# EAGLE design v1 (EAGLE 7.1.0)
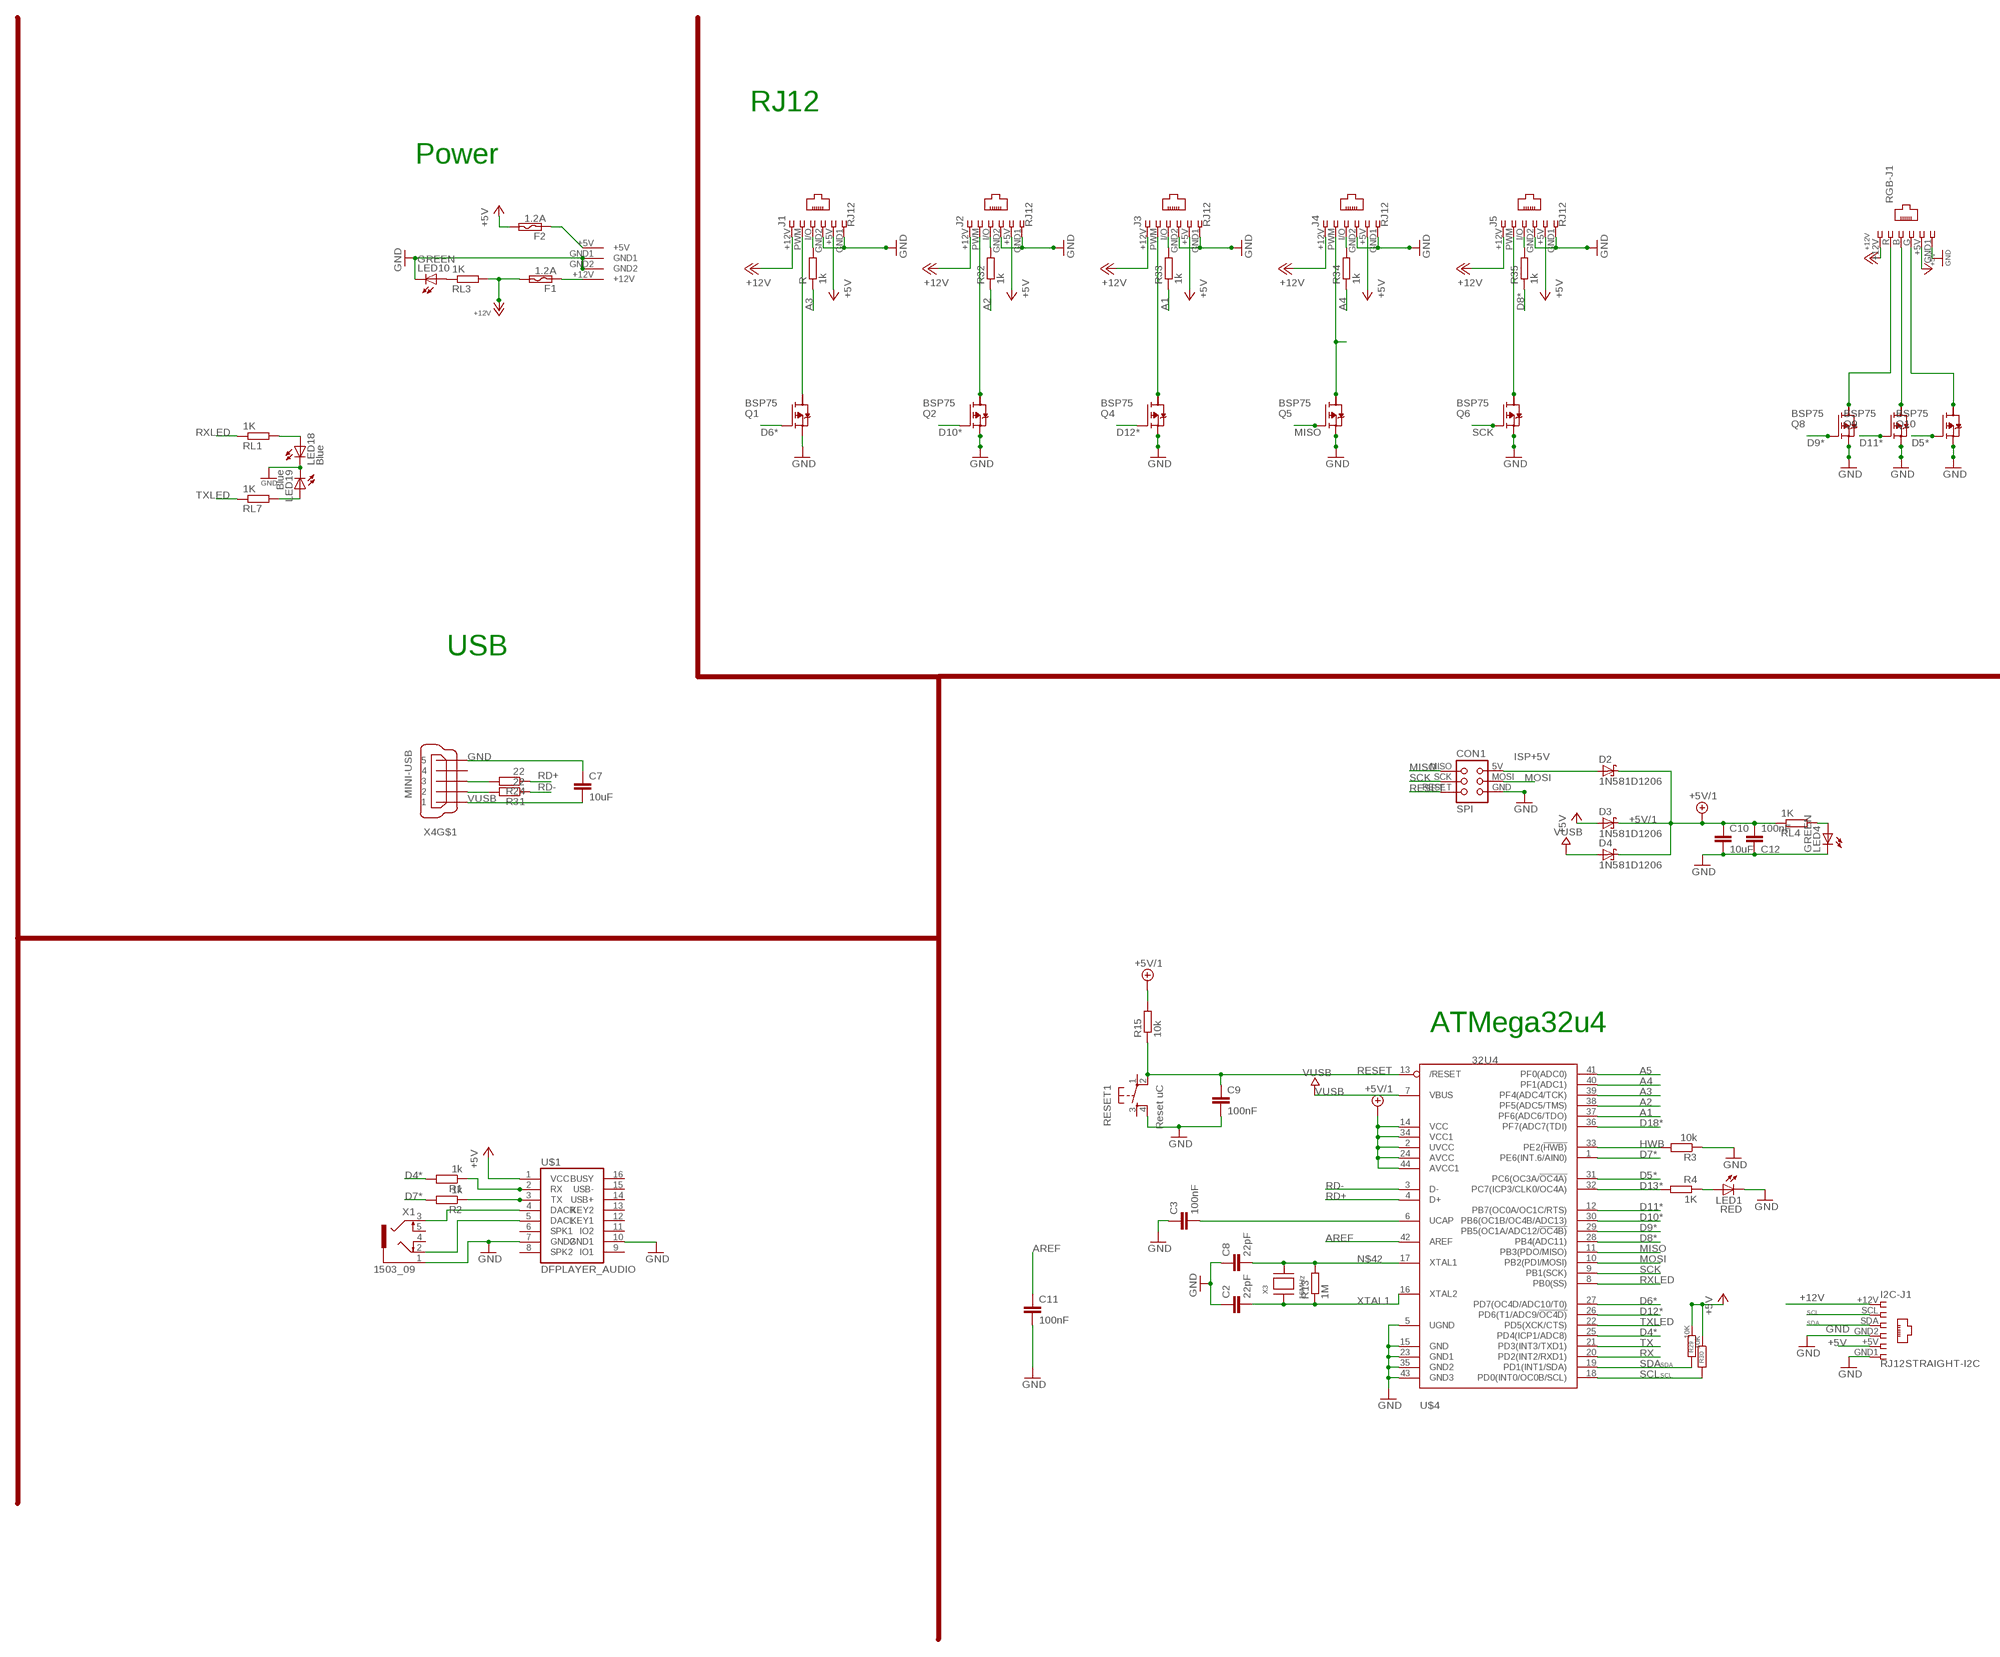
[diagram p0: schematic, sheet 1, part 1 of 2]
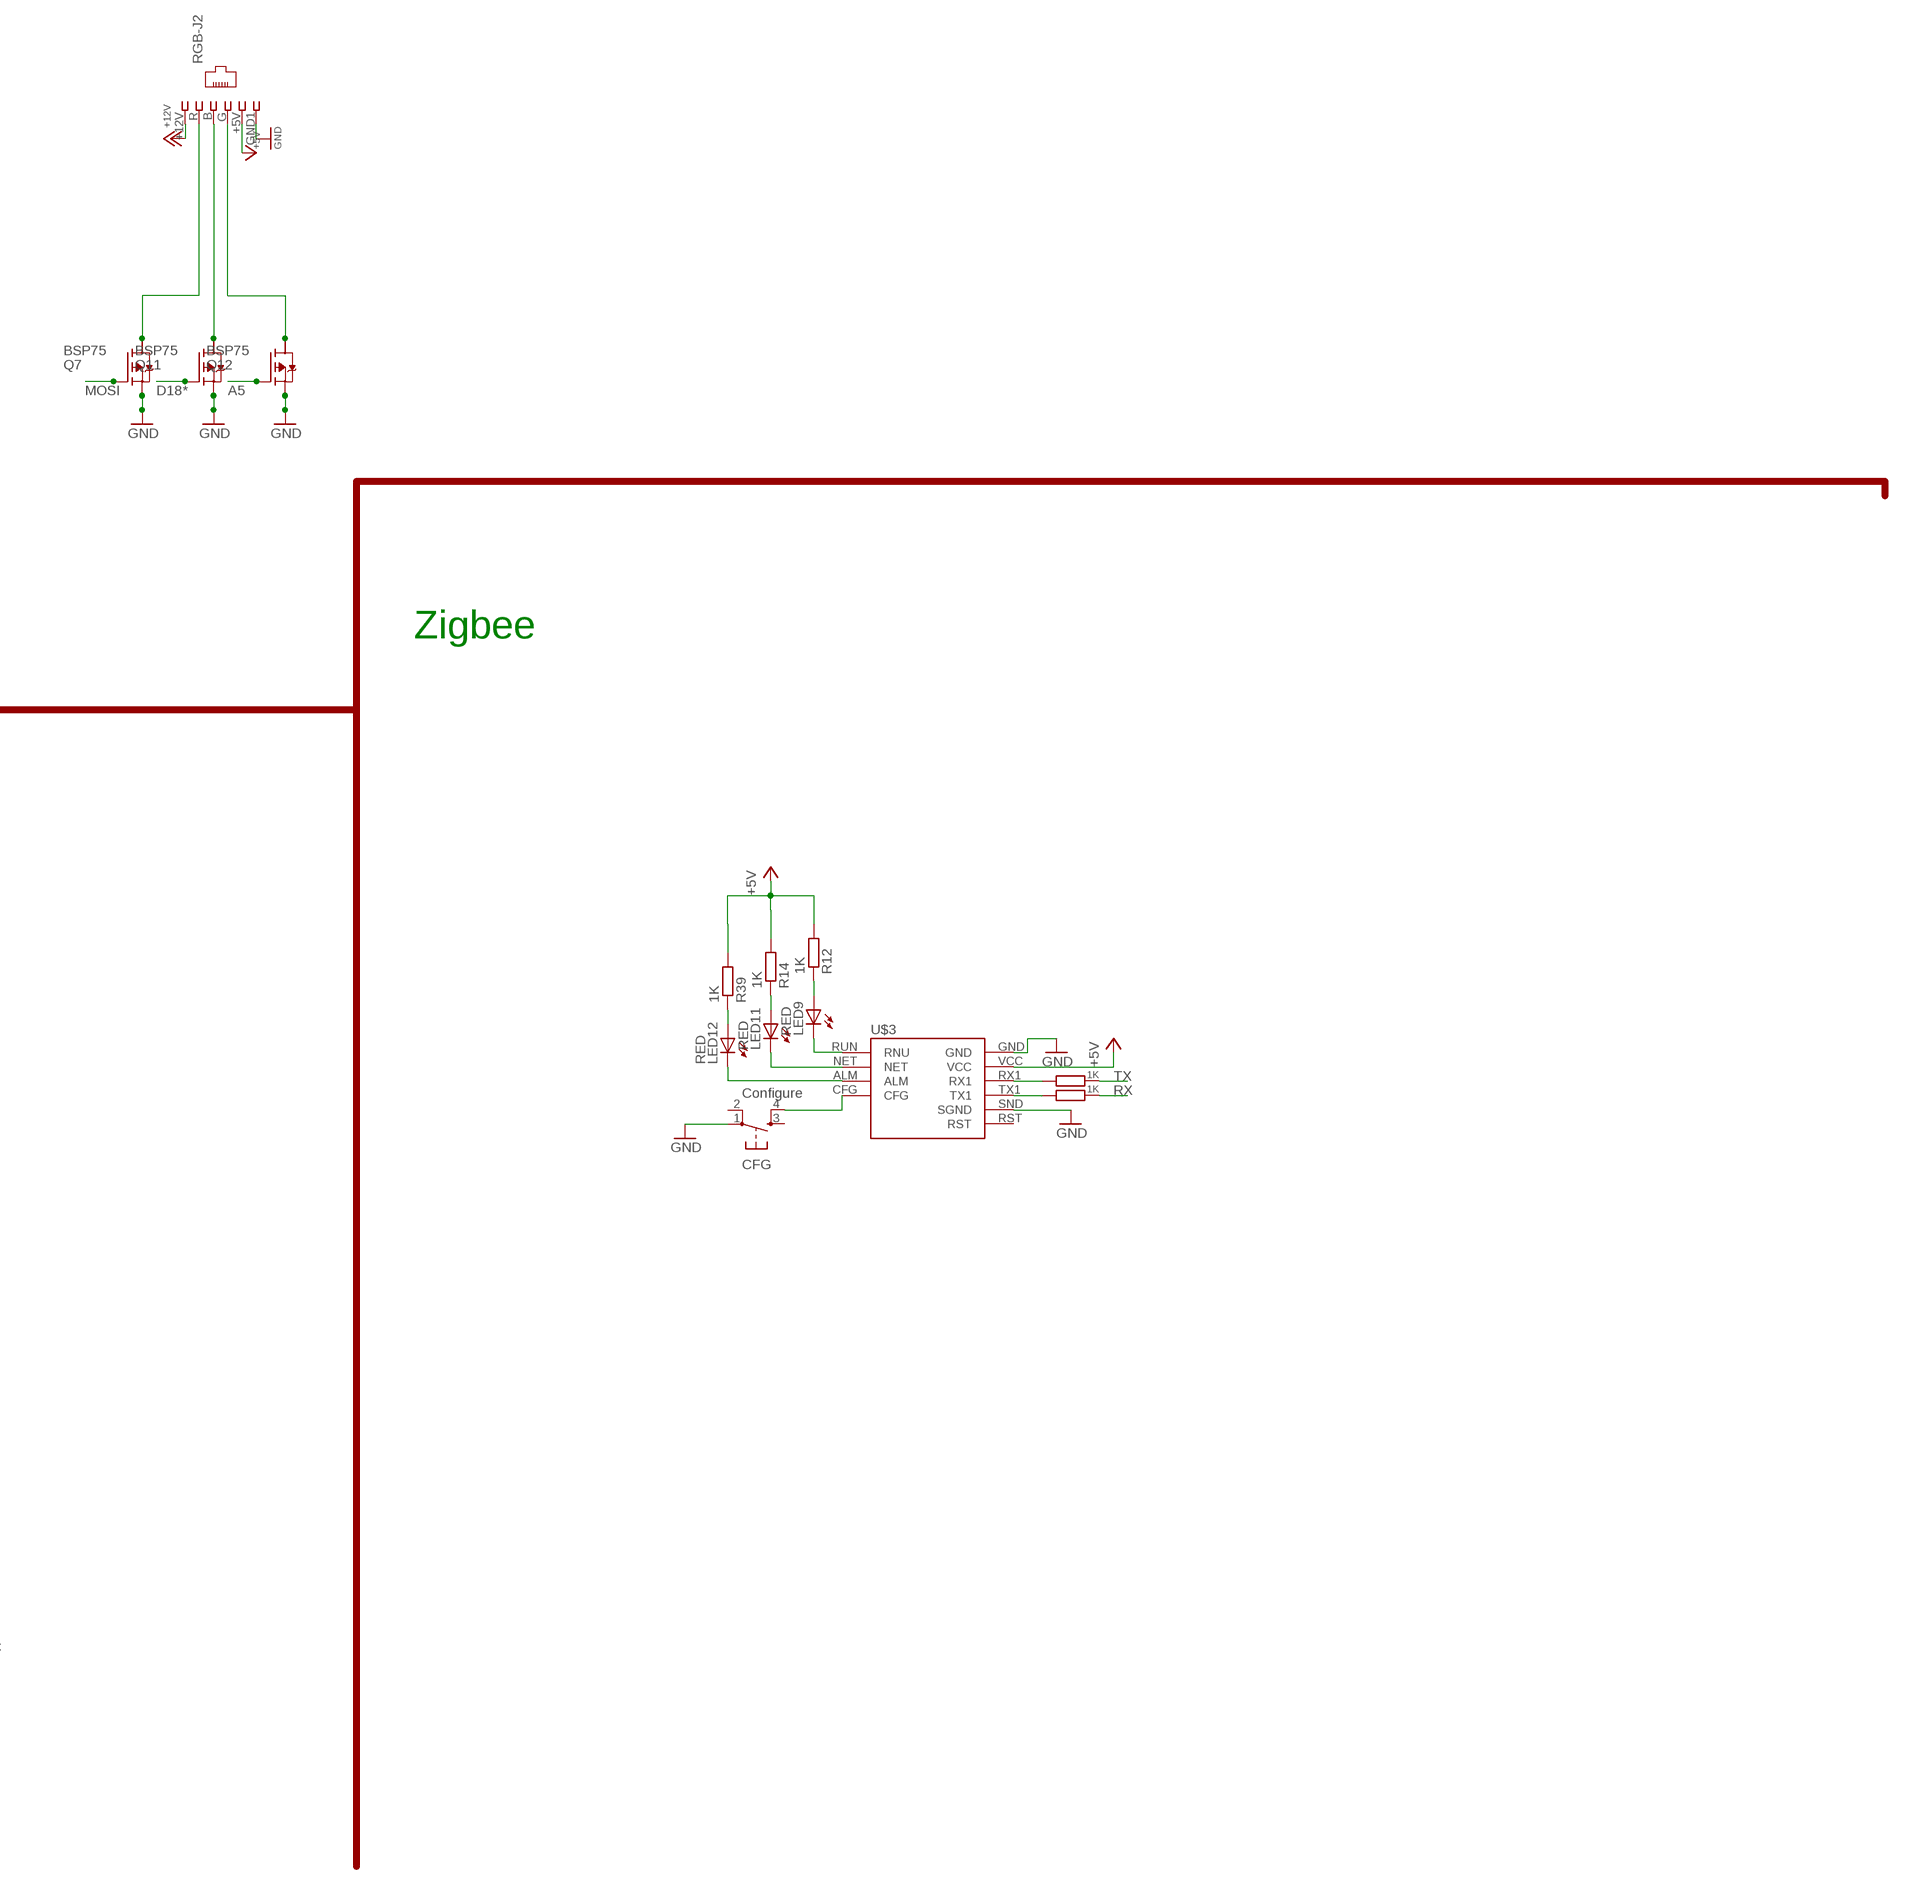
[diagram p1: schematic, sheet 1, part 2 of 2]

## Parts
C2  22pF  C-EUC1206  [C1206]
C3  100nF  C-EUC1206  [C1206]
C7  10uF  C-EUC1206  [C1206]
C8  22pF  C-EUC1206  [C1206]
C9  100nF  C-EUC1206  [C1206]
C10  10uF  C-EUC1206  [C1206]
C11  100nF  C-EUC1206  [C1206]
C12  100nF  C-EUC1206  [C1206]
CFG  Configure  TAC_SWITCHSMD  [TACTILE_SWITCH_SMD]
CON1  SPI  TINYISPT  [TC2030-MCP-NL]
D2  1N581D1206  [LED-1206]
D3  1N581D1206  [LED-1206]
D4  1N581D1206  [LED-1206]
F1  1.2A  POLYSWITCHSMD1812  [C1812]
F2  1.2A  POLYSWITCHSMD1812  [C1812]
I2C-J1  RJ12STRAIGHT-I2C  [RJ12-STRAIGHT-I2C]
J1  RJ12  RJ12STRAIGHT  [RJ12-STRAIGHT]
J2  RJ12  RJ12STRAIGHT  [RJ12-STRAIGHT]
J3  RJ12  RJ12STRAIGHT  [RJ12-STRAIGHT]
J4  RJ12  RJ12STRAIGHT  [RJ12-STRAIGHT]
J5  RJ12  RJ12STRAIGHT  [RJ12-STRAIGHT]
LED1  RED  LEDCHIP-LED0805  [CHIP-LED0805]
LED4  GREEN  LEDCHIP-LED0805  [CHIP-LED0805]
LED9  RED  LEDCHIP-LED0805  [CHIP-LED0805]
LED10  GREEN  LEDCHIP-LED0805  [CHIP-LED0805]
LED11  RED  LEDCHIP-LED0805  [CHIP-LED0805]
LED12  RED  LEDCHIP-LED0805  [CHIP-LED0805]
LED18  Blue  LEDCHIP-LED0805  [CHIP-LED0805]
LED19  Blue  LEDCHIP-LED0805  [CHIP-LED0805]
Q1  BSP75  BSP613P  [PG-SOT-223]
Q2  BSP75  BSP613P  [PG-SOT-223]
Q4  BSP75  BSP613P  [PG-SOT-223]
Q5  BSP75  BSP613P  [PG-SOT-223]
Q6  BSP75  BSP613P  [PG-SOT-223]
Q7  BSP75  BSP613P  [PG-SOT-223]
Q8  BSP75  BSP613P  [PG-SOT-223]
Q9  BSP75  BSP613P  [PG-SOT-223]
Q10  BSP75  BSP613P  [PG-SOT-223]
Q11  BSP75  BSP613P  [PG-SOT-223]
Q12  BSP75  BSP613P  [PG-SOT-223]
R  1k  R-EU_R0805  [R0805]
R1  1k  R-EU_R0805  [R0805]
R2  1k  R-EU_R0805  [R0805]
R3  10k  R-EU_M0805  [M0805]
R4  1K  R-EU_R0805  [R0805]
R8  1K  R-EU_R0805  [R0805]
R11  1K  R-EU_R0805  [R0805]
R12  1K  R-EU_R0805  [R0805]
R13  1M  R-EU_R1206  [R1206]
R14  1K  R-EU_R0805  [R0805]
R15  10k  R-EU_M0805  [M0805]
R24  22  R-EU_M1206  [M1206]
R29  10K  R-EU_M0805  [M0805]
R30  10K  R-EU_M0805  [M0805]
R31  22  R-EU_M1206  [M1206]
R32  1k  R-EU_R0805  [R0805]
R33  1k  R-EU_R0805  [R0805]
R34  1k  R-EU_R0805  [R0805]
R35  1k  R-EU_R0805  [R0805]
R39  1K  R-EU_R0805  [R0805]
RESET1  Reset uC  TAC_SWITCHSMD  [TACTILE_SWITCH_SMD]
RGB-J1  RJ12  RJ12STRAIGHT-RGB  [RJ12-STRAIGHT-RGB]
RGB-J2  RJ12  RJ12STRAIGHT-RGB  [RJ12-STRAIGHT-RGB]
RL1  1K  R-EU_R0805  [R0805]
RL3  1K  R-EU_R0805  [R0805]
RL4  1K  R-EU_R0805  [R0805]
RL7  1K  R-EU_R0805  [R0805]
U$1  DFPLAYER_AUDIO  [DIL16-7]
U$3  SZ05-ZIGBEESMD  [SZ05-ZIGBEE3]
U$4  32U4  ATMEGA32U4-AU  [TQFP44]
U$6  KPJX-4S-S  [KPJX-4S-S]
X1  1503_09  [1503_09]
X3  16MHz  XTALNX6035  [NX6035]
X4  MINI-USB  MINI-USB-SCHIELD-32005-201  [32005-201]

## Nets
+5V [power]: D3.A F2.2 I2C-J1.+5V J1.+5V J2.+5V J3.+5V J4.+5V J5.+5V R12.2 R14.2 R29.1 R30.1 R39.2 RGB-J1.+5V RGB-J2.+5V U$1.1(VCC) U$3.VCC
+5V/1 [fine]: C10.1 C12.2 D2.C D3.C D4.C R15.2 RL4.1 U$4.2(UVCC) U$4.14(VCC) U$4.24(AVCC) U$4.34(VCC1) U$4.44(AVCC1)
+12V [power]: F1.2 I2C-J1.+12V J1.+12V J2.+12V J3.+12V J4.+12V J5.+12V RGB-J1.+12V RGB-J2.+12V RL3.2
A1: R33.1 U$4.37(PF6(ADC6/TDO))
A2: R32.1 U$4.38(PF5(ADC5/TMS))
A3: R.1 U$4.39(PF4(ADC4/TCK))
A4: R34.1 U$4.40(PF1(ADC1))
A5: Q12.1(G) U$4.41(PF0(ADC0))
AREF: C11.1 U$4.42(AREF)
D4*: R1.2 U$4.25(PD4(ICP1/ADC8))
D5*: Q10.1(G) U$4.31(PC6(OC3A/!OC4A))
D6*: Q1.1(G) U$4.27(PD7(OC4D/ADC10/T0))
D7*: R2.2 U$4.1(PE6(INT.6/AIN0))
D8*: R35.1 U$4.28(PB4(ADC11))
D9*: Q8.1(G) U$4.29(PB5(OC1A/ADC12/!OC4B))
D10*: Q2.1(G) U$4.30(PB6(OC1B/OC4B/ADC13))
D11*: Q9.1(G) U$4.12(PB7(OC0A/OC1C/RTS))
D12*: Q4.1(G) U$4.26(PD6(T1/ADC9/!OC4D))
D13*: R4.2 U$4.32(PC7(ICP3/CLK0/OC4A))
D18*: Q11.1(G) U$4.36(PF7(ADC7(TDI))
D+USB: R24.2 X4.3
D-USB: R31.2 X4.2
GND [power]: C2.1 C3.1 C7.1 C8.1 C9.2 C10.2 C11.2 C12.1 CFG.1 CON1.GND I2C-J1.GND1 I2C-J1.GND2 J1.GND1 J1.GND2 J2.GND1 J2.GND2 J3.GND1 J3.GND2 J4.GND1 J4.GND2 J5.GND1 J5.GND2 LED1.C LED4.C LED10.C LED18.C LED19.C Q1.3(S) Q2.3(S) Q4.3(S) Q5.3(S) Q6.3(S) Q7.3(S) Q8.3(S) Q9.3(S) Q10.3(S) Q11.3(S) Q12.3(S) R3.1 RESET1.4 RGB-J1.GND1 RGB-J2.GND1 U$1.7(GND2) U$1.10(GND1) U$3.GND U$3.SND(SGND) U$4.5(UGND) U$4.15(GND) U$4.23(GND1) U$4.35(GND2) U$4.43(GND3) U$6.GND1 U$6.GND2 X1.1 X4.5
GND1 [VIN]: LED9.C U$3.RUN(RNU)
GND2 [VIN]: LED11.C U$3.NET
GND3 [VIN]: LED12.C U$3.ALM
HWB: R3.2 U$4.33(PE2(!HWB))
ISP+5V: CON1.5V(VCC) D2.A
MISO: CON1.MISO Q5.1(G) U$4.11(PB3(PDO/MISO))
MOSI: CON1.MOSI Q7.1(G) U$4.10(PB2(PDI/MOSI))
N$1: J3.PWM Q4.2(D)
N$2: J2.I/O R32.2
N$3: R1.1 U$1.2(RX)
N$4: LED1.A R4.1
N$5: J4.PWM Q5.2(D)
N$6 [aref]: Q10.2(D) RGB-J1.G
N$7: J3.I/O R33.2
N$8: LED18.A RL1.2
N$9: U$1.5(DACL) X1.2
N$10 [aref]: Q11.2(D) RGB-J2.B
N$11: R11.2 U$3.RX1
N$12: LED4.A RL4.2
N$13: R2.1 U$1.3(TX)
N$14: LED19.A RL7.2
N$15: U$1.4(DACR) X1.3
N$16: C3.2 U$4.6(UCAP)
N$18: J1.I/O R.2
N$19: J5.PWM Q6.2(D)
N$20 [aref]: Q7.2(D) RGB-J2.R
N$23 [aref]: Q12.2(D) RGB-J2.G
N$24: R8.2 U$3.TX1
N$25: LED9.A R12.1
N$26: LED11.A R14.1
N$27: LED12.A R39.1
N$28: J2.PWM Q2.2(D)
N$29: J4.I/O R34.2
N$32: J5.I/O R35.2
N$34: J1.PWM Q1.2(D)
N$35: CFG.4 U$3.CFG
N$38: F2.1 U$6.+5V
N$39: F1.1 U$6.+12V
N$42: C8.2 R13.2 U$4.17(XTAL1) X3.P$2
N$50 [aref]: Q9.2(D) RGB-J1.B
N$68 [aref]: Q8.2(D) RGB-J1.R
N$75: LED10.A RL3.1
RD+: R24.1 U$4.4(D+)
RD-: R31.1 U$4.3(D-)
RESET: C9.1 CON1.RESET R15.1 RESET1.2 U$4.13(/RESET)
RX: R8.1 U$4.20(PD2(INT2/RXD1))
RXLED: RL1.1 U$4.8(PB0(SS))
SCK: CON1.SCK Q6.1(G) U$4.9(PB1(SCK))
SCL: I2C-J1.SCL R30.2 U$4.18(PD0(INT0/OC0B/SCL))
SDA: I2C-J1.SDA R29.2 U$4.19(PD1(INT1/SDA))
TX: R11.1 U$4.21(PD3(INT3/TXD1))
TXLED: RL7.1 U$4.22(PD5(XCK/CTS))
VUSB: C7.2 D4.A U$4.7(VBUS) X4.1
XTAL1: C2.2 R13.1 U$4.16(XTAL2) X3.P$1
Unconnected: CFG.2 CFG.3 Q1.4(D) Q2.4(D) Q4.4(D) Q5.4(D) Q6.4(D) Q7.4(D) Q8.4(D) Q9.4(D) Q10.4(D) Q11.4(D) Q12.4(D) RESET1.1 RESET1.3 U$1.6(SPK1) U$1.8(SPK2) U$1.9(IO1) U$1.11(IO2) U$1.12(KEY1) U$1.13(KEY2) U$1.14(USB+) U$1.15(USB-) U$1.16(BUSY) U$3.RST X1.4 X1.5 X4.4 X4.M1(S:S1) X4.M2(S:S2) X4.M3(S:S3) X4.M4(S:S4)

## Notes on the sheet
- RJ12
- Power
- Zigbee
- USB
- ATMega32u4

## Library data of the parts
C2 C3 C7-C12 = rcl:C-EU: CAPACITOR, European symbol
CFG RESET1 = lpatiny:TAC_SWITCH: Momentary Switch Button commonly used for reset or general input. Spark Fun Electronics SKU : COM-00097
CON1 = lpatiny:TINYISP: CONNECTOR
D2-D4 = lpatiny:1N581*: 1.0A SCHOTTKY BARRIER RECTIFIER Source: http://www.diodes.com/datasheets/ds23001.pdf
F1 F2 = lpatiny:POLYSWITCH: PolySwitch (TM) Resettable Device Source: Data sheet <http://www.farnell.com/datasheets/13482.pdf>
I2C-J1 J1-J5 RGB-J1 RGB-J2 = lpatiny:RJ12: CORCOM Modular RJ Jacks No Shield Source: www.tycoelectronics.com .. ENG_DS_1654001_1099_RJ_L_0507.pdf
LED1 LED4 LED9-LED12 LED18 LED19 = adafruit:LED: LED OSRAM: - CHIPLED LG R971, LG N971, LY N971, LG Q971, LY Q971, LO R971, LY R971 LH N974, LH R974 LS Q976, LO Q976, LY Q976 LO Q996 - Hyper CHIPLED LW Q18S LB Q993, LB Q99A, LB R99A - SideLED LS A670, LO A670, LY A670, LG A670, LP A670 LB A673, LV A673, LT A673, LW A673 LH A674 LY A675 LS A676, LA A676, LO A676, LY A676, LW A676 LS A679, LY A679, LG A679 - Hyper Micro SIDELED® LS Y876, LA Y876, LO Y876, LY Y876 LT Y87S - SmartLED LW L88C, LW L88S LB L89C, LB L89S, LG L890 LS L89K, LO L89K, LY L89K LS L896, LA L896, LO L896, LY L896 - TOPLED LS T670, LO T670, LY T670, LG T670, LP T670 LSG T670, LSP T670, LSY T670, LOP T670, LYG T670 LG T671, LOG T671, LSG T671 LB T673, LV T673, LT T673, LW T673 LH T674 LS T676, LA T676, LO T676, LY T676, LB T676, LH T676, LSB T676, LW T676 LB T67C, LV T67C, LT T67C, LS T67K, LO T67K, LY T67K, LW E67C LS E67B, LA E67B, LO E67B, LY E67B, LB E67C, LV E67C, LT E67C LW T67C LS T679, LY T679, LG T679 LS T770, LO T770, LY T770, LG T770, LP T770 LB T773, LV T773, LT T773, LW T773 LH T774 LS E675, LA E675, LY E675, LS T675 LS T776, LA T776, LO T776, LY T776, LB T776 LHGB T686 LT T68C, LB T68C - Hyper Mini TOPLED® LB M676 - Mini TOPLED Santana® LG M470 LS M47K, LO M47K, LY M47K Source: http://www.osram.convergy.de/
Q1 Q2 Q4-Q12 = infineon:BSP613P: SIPMOS (R) Small-Signal-Transistor P-Channel (2 Drain) Source: http://www.infineon.com/dgdl/BSP613P_Rev2.4.pdf; OC_FARNELL: unknown; OC_NEWARK: unknown
R R1 R2 R4 R8 R11-R14 R32-R35 R39 RL1 RL3 RL7 = rcl:R-EU_: RESISTOR, European symbol
R3 R15 R24 R29-R31 RL4 = resistor:R-EU_: RESISTOR, European symbol
U$1 = lpatiny:DFPLAYER_AUDIO
U$3 = lpatiny:SZ05-ZIGBEE
U$4 = adafruit:ATMEGA32U4: http://www.ladyada.net/library/eagle
U$6 = lpatiny:KPJX-4S-S
X1 = con-lumberg:1503_09: Jack connectors according to JISC 6560, 3.5 mm Klinkeneinbaukupplung nach JISC 6560, 3,5 mm, 3-polig/ stereo, abgewinkelte Ausführung, mit 2 Öffnern und Lötaugen, für Leiterplatten Rückseitenmontage Source: http://www.lumberg.com/Produkte/PDFs/1503_09.pdf; OC_FARNELL: 1243244; OC_NEWARK: unknown
X3 = lpatiny:XTAL: Low cost SMT crystals, no capacitors included http://www.ladyada.net/library/eagle
X4 = con-cypressindustries:MINI-USB-SCHIELD-: MINI USB-B Conector Source: www.cypressindustries.com; OC_FARNELL: unknown; OC_NEWARK: unknown

## Net classes
0 default: width 0.406 mm
1 power: width 0.457 mm
2 VIN: width 0.457 mm
3 fine: width 0.406 mm
4 aref: width 0.406 mm

## Board
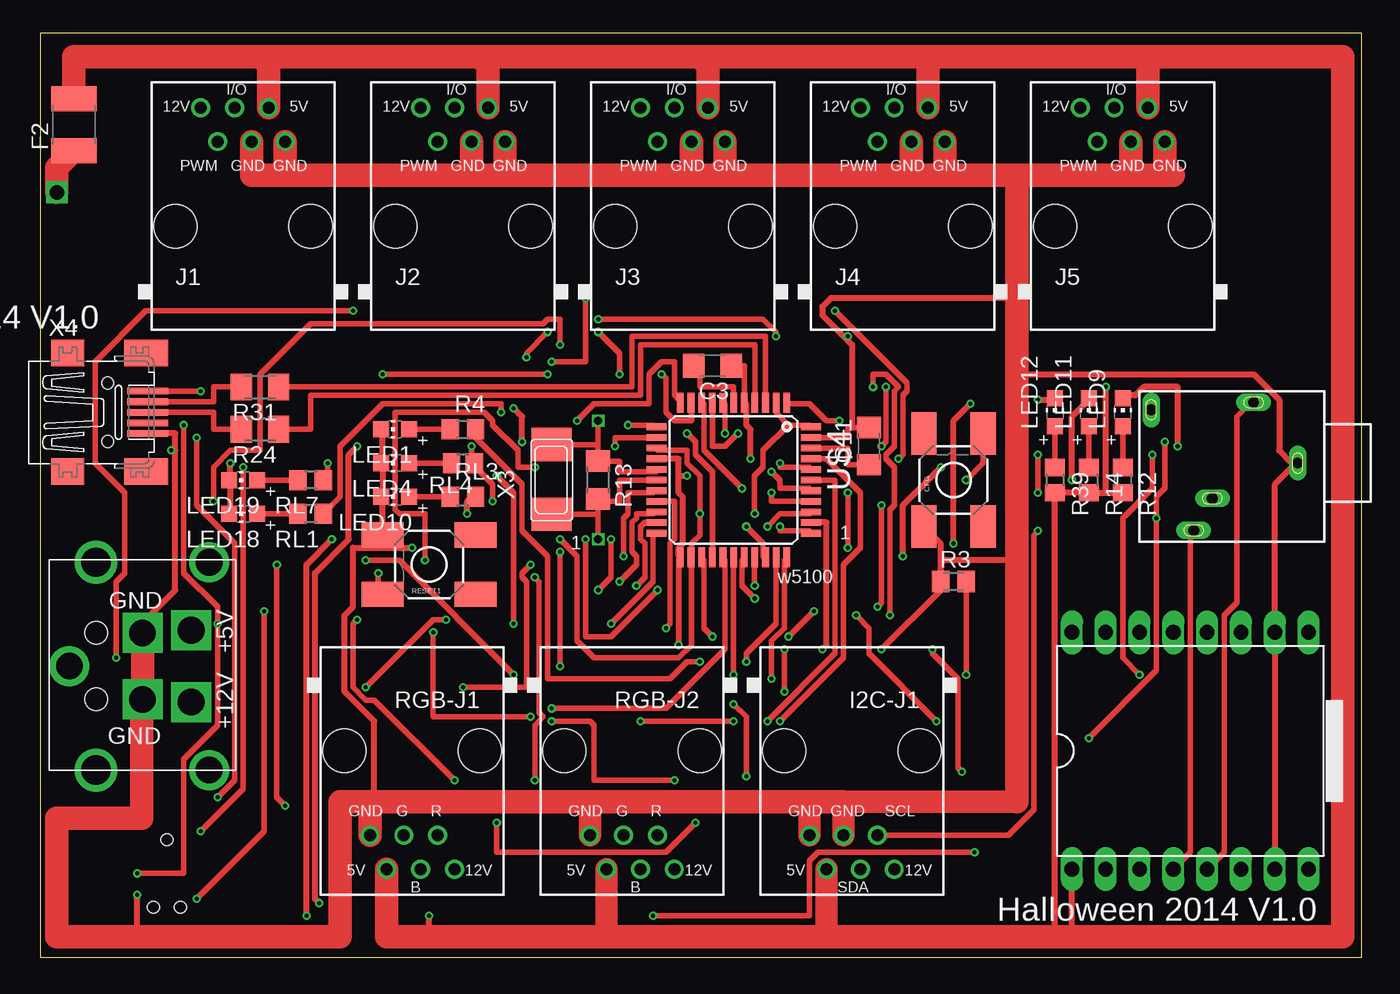
[diagram p2: board, top side]
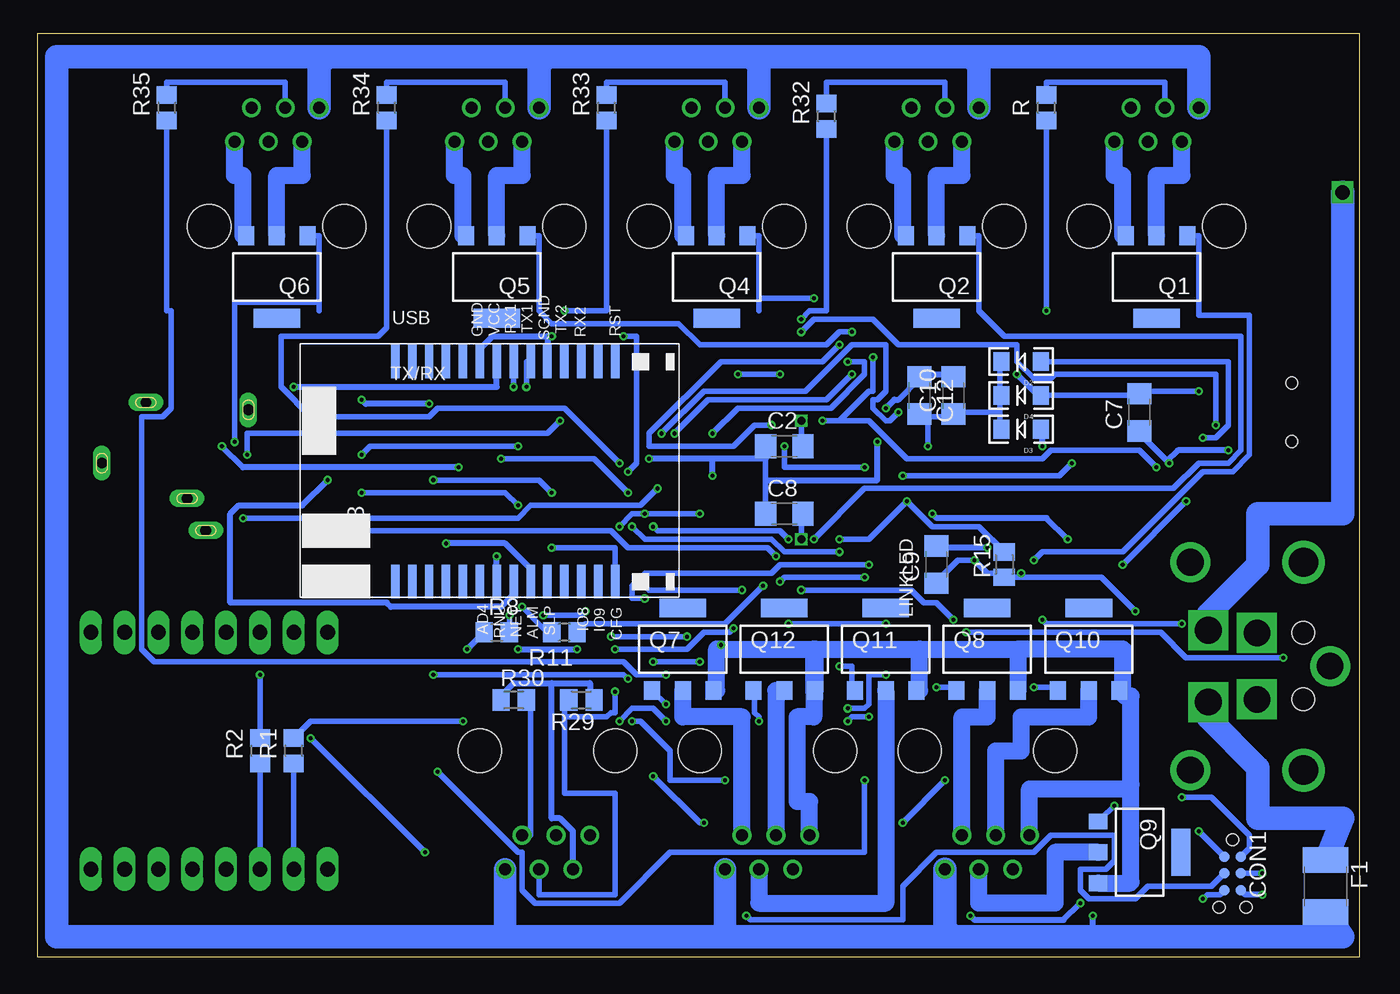
[diagram p3: board, bottom side, seen from below]

Size 99.24 x 69.33 mm. Coordinates in mm from the lower left corner, seen from the top.
Outline: 0,0 99.24,0 99.24,69.33 0,69.33 0,0
Copper layers (1*16): Top 0.035mm / dielectric 1.5mm / Bottom 0.035mm
Design rules "Fusion_eagle_rule_v1.1": minimum track width 6mil, minimum drill 12mil, track to track 6mil, track to pad 6mil, pad to pad 6mil, via to via 6mil, smd to smd 0mil, copper to edge 10mil, drill to drill 10mil, minimum pad ring 10mil, minimum via ring 6mil, stop-mask expansion 2mil, vias tented up to drill 100mil, thermal gap 10mil
bKeepout: area -1.3,54.9 to 114.3,82.8; area -7.6,52.3 to 108,80.3
tRestrict: area 0,51.1 to 95.2,72.6
bRestrict: area 0,49.8 to 95.2,71.4
vRestrict: area 44.5,28.2 to 59.7,32; area 44.5,29.5 to 48.3,43.4; area 55.9,30.7 to 59.7,43.4; area 44.5,39.6 to 59.7,43.4; area 7.6,4.1 to 11.4,9.1

### Footprints (pad centres in the part's own frame; a part is rotated, then mirrored left to right if it is on the bottom)
C1206 = smd 1.6 x 1.8: 1 -1.4,0; 2 1.4,0
TACTILE_SWITCH_SMD = smd 3.175 x 1.905: 1 -3.493,2.223; 2 3.493,2.223; 3 -3.493,-2.223; 4 3.493,-2.223
TC2030-MCP-NL = smd 0.787 x 0.787: 5V 1.27,0.635; GND 3.81,0.635; MISO 1.27,-0.635; MOSI 2.54,0.635; RESET 3.81,-0.635; SCK 2.54,-0.635 | hole 0.889: 0,0; 5.08,-1.016; 5.08,1.016
LED-1206 = smd 1.2 x 1.4: A -1.5,0; C 1.5,0
C1812 = smd 1.9 x 3.4: 1 -1.95,0; 2 1.95,0
RJ12-STRAIGHT-I2C = drill 0.9 pad 1.4: +5V 1.905,8.89; +12V -3.175,8.89; GND1 3.175,6.35; GND2 0.635,6.35; SCL -1.905,6.35; SDA -0.635,8.89 | hole 3.251: -5.08,0; 5.08,0
RJ12-STRAIGHT = drill 0.9 pad 1.4: +5V 1.905,8.89; +12V -3.175,8.89; GND1 3.175,6.35; GND2 0.635,6.35; I/O -0.635,8.89; PWM -1.905,6.35 | hole 3.251: -5.08,0; 5.08,0
CHIP-LED0805 = smd 1.2 x 1.2: A 0,-1.05; C 0,1.05
PG-SOT-223 = smd 1.2 x 1.4: 1 -2.311,-3.099; 2 0,-3.099; 3 2.311,-3.099 | smd 3.5 x 1.4: 4 0,3.099
R0805 = smd 1.3 x 1.5: 1 -0.95,0; 2 0.95,0
M0805 = smd 1.3 x 1.6: 1 -0.95,0; 2 0.95,0
R1206 = smd 1.6 x 1.803: 1 -1.422,0; 2 1.422,0
M1206 = smd 1.6 x 2: 1 -1.4,0; 2 1.4,0
RJ12-STRAIGHT-RGB = drill 0.9 pad 1.4: +5V 1.905,8.89; +12V -3.175,8.89; B -0.635,8.89; G 0.635,6.35; GND1 3.175,6.35; R -1.905,6.35 | hole 3.251: -5.08,0; 5.08,0
R0805' = smd 1.3 x 1.5: 1 -0.85,0; 2 0.85,0
DIL16-7 = drill 1.1 long: 1 -8.89,-8.89; 2 -6.35,-8.89; 3 -3.81,-8.89; 4 -1.27,-8.89; 5 1.27,-8.89; 6 3.81,-8.89; 7 6.35,-8.89; 8 8.89,-8.89; 9 8.89,8.89; 10 6.35,8.89; 11 3.81,8.89; 12 1.27,8.89; 13 -1.27,8.89; 14 -3.81,8.89; 15 -6.35,8.89; 16 -8.89,8.89
SZ05-ZIGBEE3 = smd 2.54 x 0.635: AD1 -7.62,6.35; AD2 -7.62,5.08; AD3 -7.62,3.81; AD4 -7.62,2.54; ALM -7.62,-1.27; C485 -7.62,-3.81; CFG -7.62,-7.62; GND 8.89,2.54; IO1 -7.62,8.89; IO2 -7.62,7.62; IO3 8.89,8.89; IO4 8.89,7.62; IO5 8.89,6.35; IO6 8.89,5.08; IO7 8.89,3.81; IO8 -7.62,-5.08; IO9 -7.62,-6.35; MS 8.89,-6.35; NET -7.62,0; RST 8.89,-7.62; RUN -7.62,1.27; RX1 8.89,0; RX2 8.89,-5.08; SLD -7.62,-2.54; SND 8.89,-2.54; TX1 8.89,-1.27; TX2 8.89,-3.81; VCC 8.89,1.27
TQFP44 = smd 1.5 x 0.5: 1 -5.8,4; 2 -5.8,3.2; 3 -5.8,2.4; 4 -5.8,1.6; 5 -5.8,0.8; 6 -5.8,0; 7 -5.8,-0.8; 8 -5.8,-1.6; 9 -5.8,-2.4; 10 -5.8,-3.2; 11 -5.8,-4; 23 5.8,-4; 24 5.8,-3.2; 25 5.8,-2.4; 26 5.8,-1.6; 27 5.8,-0.8; 28 5.8,0; 29 5.8,0.8; 30 5.8,1.6; 31 5.8,2.4; 32 5.8,3.2; 33 5.8,4 | smd 0.5 x 1.5: 12 -4,-5.8; 13 -3.2,-5.8; 14 -2.4,-5.8; 15 -1.6,-5.8; 16 -0.8,-5.8; 17 0,-5.8; 18 0.8,-5.8; 19 1.6,-5.8; 20 2.4,-5.8; 21 3.2,-5.8; 22 4,-5.8; 34 4,5.8; 35 3.2,5.8; 36 2.4,5.8; 37 1.6,5.8; 38 0.8,5.8; 39 0,5.8; 40 -0.8,5.8; 41 -1.6,5.8; 42 -2.4,5.8; 43 -3.2,5.8; 44 -4,5.8
KPJX-4S-S = drill 2 square: +5V 2.7,1.35; +12V -2.7,1.35; GND1 -2.5,5; GND2 2.5,5 | drill 2: P$1 -7.8,0; P$2 7.8,0; P$11 0,10.5 | drill 2.2: P$3 -7.8,8.5; P$4 7.8,8.5 | hole 1.7: -2.5,8.5; 2.5,8.5
1503_09 = drill 0.8 pad 1.2 long: 1 0,-2.1; 2 -4.55,-5.4; 3 5.05,-9.9; 4 -4,-13.1; 5 2.65,-8.5
NX6035 = smd 2.5 x 3: P$1 2.665,0; P$2 -2.565,0
32005-201 = smd 3.1 x 0.5: 1 3,1.6; 2 3,0.8; 3 3,0; 4 3,-0.8; 5 3,-1.6 | smd 2.5 x 2: M1 -3,-4.45; M2 -3,4.45 | smd 3.3 x 2: M3 2.9,4.45; M4 2.9,-4.45 | hole 0.9: 0,2.2; 0,-2.2

### Placement (x,y rotation side)
C2  43.18,38.35 0 bottom
C3  50.48,44.39 180 top
C7  16.51,40.89 90 bottom
C8  43.18,33.27 0 bottom
C9  31.75,29.46 90 bottom
C10  30.48,42.16 90 bottom
C11  62.23,38.35 90 top
C12  33.02,42.16 270 bottom
CFG  68.58,35.81 90 top
CON1  9.53,8.83 270 bottom
D2  25.4,44.7 180 bottom
D3  25.4,39.62 180 bottom
D4  25.4,42.16 180 bottom
F1  2.54,5.33 270 bottom
F2  2.54,62.48 90 top
I2C-J1  60.96,15.49 180 top
J1  15.24,54.86 0 top
J2  31.75,54.86 0 top
J3  48.26,54.86 0 top
J4  64.77,54.86 0 top
J5  81.28,54.86 0 top
LED1  26.67,39.62 90 top
LED4  26.67,37.08 90 top
LED9  81.28,40.89 0 top
LED10  26.67,34.54 90 top
LED11  78.74,40.89 0 top
LED12  76.2,40.89 0 top
LED18  15.24,33.27 90 top
LED19  15.24,35.81 90 top
Q1  15.24,51.05 180 bottom
Q2  31.75,51.05 180 bottom
Q4  48.26,51.05 180 bottom
Q5  64.77,51.05 180 bottom
Q6  81.28,51.05 180 bottom
Q7  50.8,23.11 0 bottom
Q8  27.94,23.11 0 bottom
Q9  16.51,7.87 270 bottom
Q10  20.32,23.11 0 bottom
Q11  35.56,23.11 0 bottom
Q12  43.18,23.11 0 bottom
R  23.5,63.75 90 bottom
R1  80.01,15.49 90 bottom
R2  82.55,15.49 90 bottom
R3  68.58,28.19 0 top
R4  31.75,39.62 0 top
R8  64.77,24.38 0 bottom
R11  59.69,24.38 180 bottom
R12  81.28,35.81 270 top
R13  41.91,35.81 270 top
R14  78.74,35.81 270 top
R15  26.67,29.46 90 bottom
R24  16.51,39.62 180 top
R29  58.42,19.3 180 bottom
R30  63.5,19.3 0 bottom
R31  16.51,42.8 180 top
R32  40.01,63.12 90 bottom
R33  56.52,63.75 90 bottom
R34  73.03,63.75 90 bottom
R35  89.53,63.75 90 bottom
R39  76.2,35.81 270 top
RESET1  29.21,29.46 180 top
RGB-J1  27.94,15.49 180 top
RGB-J2  44.45,15.49 180 top
RL1  20.32,33.27 180 top
RL3  31.75,34.54 0 top
RL4  1K  [R0805']  31.75,37.08 180 top
RL7  20.32,35.81 180 top
U$1  86.36,15.49 0 top
U$3  63.5,35.81 90 bottom
U$4  52.07,35.81 270 top
U$6  12.7,21.84 90 top
X1  96.52,37.08 270 top
X3  38.42,35.81 90 top
X4  5.08,40.89 0 top

### Tracks (layer width: path | path; a pad name or v marks a point on that pad's centre or on a via)
+5V  (via drill 0.3)
  Top 0.457: R14.2 R39.2 | R14.2 80.01,34.86 | 80.01,34.86 R12.2 | R14.2 | 80.01,34.86 v80.01,42.8 | v23.81,38.35 23.18,37.72 23.18,31.37 20.64,28.83 20.64,4.38 v20.95,4.06 | 29.21,1.52 v29.21,3.11 | 77.47,1.52 U$1.1 | 76.2,1.52 R39.2 | R39.2
  Top 1.676: I2C-J1.+5V 59.05,1.52 | RGB-J2.+5V 42.55,1.52
  Top 1.778: F2.2 2.54,67.56 16.51,67.56 | 16.51,67.56 33.02,67.56 | 33.02,67.56 49.53,67.56 | 49.53,67.56 67.31,67.56 | 67.31,67.56 83.82,67.56 | 83.82,67.56 97.79,67.56 97.79,1.52 77.47,1.52 76.2,1.52 59.05,1.52 42.55,1.52 29.21,1.52 26.04,1.52 RGB-J1.+5V | J1.+5V 17.14,66.93 16.51,67.56 | J2.+5V 33.66,66.93 33.02,67.56 | J3.+5V 50.16,66.93 49.53,67.56 | J4.+5V 66.67,66.93 67.31,67.56 | J5.+5V 83.19,66.93 83.82,67.56
  Bottom 0.457: U$3.VCC 64.77,42.8 v80.01,42.8 | 60.64,20.57 63.5,20.57 64.14,19.94 64.14,19.3 R30.1 | 60.64,20.57 57.78,20.57 57.78,19.3 R29.1 | v23.81,38.35 23.81,39.62 D3.A | v20.95,4.06 22.23,2.79 28.89,2.79 v29.21,3.11 | 60.64,20.57 60.64,10.41 60.01,10.41 59.05,9.46 I2C-J1.+5V
+5V/1  (via drill 0.3)
  Top 0.406: v32.38,38.35 32.38,37.08 RL4.1 32.7,37.08 32.7,36.77 33.97,35.5 v33.97,34.23 | 56.2,39.94 55.24,40.89 55.24,41.53 U$4.2 | 56.2,39.94 57.78,39.94 U$4.44 | U$4.14 46.35,38.04 48.58,38.04 48.58,37.08 49.53,36.13 v49.53,33.27 49.53,31.69 48.9,31.05 48.9,30.1 U$4.24 48.9,29.78 48.9,23.43 47.94,22.48 41.59,22.48 40.32,23.75 40.32,30.1 v39.05,31.37 | v55.56,32.32 55.56,32 57.78,32 U$4.34 | 56.2,39.94 54.29,38.04 54.29,36.77 53.66,36.13 v53.66,33.27
  Bottom 0.406: 26.99,42.16 26.99,40.89 | 26.99,40.89 26.99,39.62 D3.C | 26.99,42.16 26.99,44.7 D2.C | 26.99,42.16 D4.C | 32.38,40.58 v32.38,38.35 | 32.38,40.58 33.02,40.58 C12.2 32.38,40.58 | R15.2 28.57,32.32 32.07,32.32 v33.97,34.23 36.83,31.37 v39.05,31.37 | 32.38,40.58 30.48,40.58 C10.1 30.48,40.89 26.99,40.89 | v55.56,32.32 54.61,33.27 v53.66,33.27 v49.53,33.27
+12V  (via drill 0.3)
  Top 0.457: v32.07,33.27 32.07,34.23 32.38,34.54 RL3.2 | v21.91,31.37 20,29.46 v20,3.11
  Bottom 0.457: v32.07,33.27 31.75,32.96 23.5,32.96 v21.91,31.37 | 20,1.52 v20,3.11
  Bottom 1.676: I2C-J1.+12V 64.14,1.52 | RGB-J2.+12V 47.62,1.52
  Bottom 1.778: F1.2 1.27,1.52 20,1.52 30.48,1.52 | 30.48,1.52 47.62,1.52 64.14,1.52 97.79,1.52 97.79,67.56 77.47,67.56 | 77.47,67.56 60.96,67.56 | 60.96,67.56 45.72,67.56 | 45.72,67.56 29.21,67.56 | 29.21,67.56 12.06,67.56 J1.+12V | J3.+12V 45.09,66.93 45.72,67.56 | J4.+12V 61.59,66.93 60.96,67.56 | J5.+12V 78.11,66.93 77.47,67.56 | J2.+12V 28.57,66.93 29.21,67.56 | RGB-J1.+12V 31.11,2.16 30.48,1.52
A1  (via drill 0.3)
  Top 0.406: v54.93,34.86 54.93,34.23 57.78,34.23 U$4.37 | v64.45,37.4 64.77,37.72 64.77,42.16 65.09,42.48 65.09,43.12 v59.69,48.51
  Bottom 0.406: R33.1 56.52,48.51 v59.69,48.51 | v54.93,34.86 57.47,37.4 v64.45,37.4
A2  (via drill 0.3)
  Top 0.406: v54.93,36.45 55.56,35.81 55.56,35.18 57.78,35.18 U$4.38 | v55.24,46.61 55.24,46.93 54.29,47.88 v41.91,47.88
  Bottom 0.406: R32.1 40.01,48.51 41.27,48.51 v41.91,47.88 | v54.93,36.45 54.29,37.08 54.29,46.61 v55.24,46.61
A3  (via drill 0.3)
  Top 0.406: U$4.39 59.69,35.81 59.69,22.8 v54.61,17.72 | v47.62,13.27 41.59,13.27 41.59,17.4 41.27,17.72 v38.42,17.72 | v36.83,18.03 29.53,18.03 v29.53,24.38 | v5.71,22.48 5.71,28.19 6.35,28.83 6.35,34.86 4.13,37.08 4.13,44.7 7.94,48.51 v23.5,48.51
  Bottom 0.406: R.1 v23.5,48.51 | v54.61,17.72 53.98,17.72 51.75,15.49 51.75,13.27 v47.62,13.27 | v38.42,17.72 38.1,18.03 v36.83,18.03 | v29.53,24.38 14.92,24.38 13.02,22.48 v5.71,22.48
A4  (via drill 0.3)
  Top 0.406: v55.56,37.08 55.56,36.77 57.78,36.77 U$4.40
  Bottom 0.406: R34.1 73.03,47.24 73.66,46.61 80.96,46.61 80.96,42.8 78.74,40.58 69.85,40.58 69.22,41.21 59.69,41.21 v55.56,37.08
A5  (via drill 0.3)
  Top 0.406: v52.07,17.72 v45.09,17.72 | v55.56,17.72 60.33,22.48 60.33,29.46 61.59,30.73 61.59,34.86 59.05,37.4 58.1,37.4 U$4.41
  Bottom 0.406: v45.09,17.72 45.09,18.03 45.4,18.35 45.4,19.94 Q12.1 | v52.07,17.72 53.02,18.67 54.61,18.67 v55.56,17.72
AREF
  Top 0.406: C11.1 60.64,36.95 60.64,38.21 U$4.42
D4*  (via drill 0.3)
  Top 0.406: v50.48,24.07 49.85,24.7 49.85,29.78 U$4.25 | v58.1,25.97 v56.2,24.07 | v61.28,25.65 62.23,24.7 62.23,22.8 v67.31,17.72
  Bottom 0.406: v56.2,24.07 v50.48,24.07 | v58.1,25.97 58.42,25.65 v61.28,25.65 | v67.31,17.72 78.74,17.72 R1.2
D5*  (via drill 0.3)
  Top 0.406: v24.45,20.26 29.53,25.34 v30.48,25.34 | v41.91,27.56 42.86,28.51 v42.86,31.37 | v53.02,32.32 54.29,31.05 54.29,30.1 U$4.31
  Bottom 0.406: v24.45,20.26 22.86,20.26 Q10.1 | v30.48,25.34 31.75,26.61 32.7,26.61 33.66,27.56 v41.91,27.56 | v42.86,31.37 43.5,32 52.7,32 v53.02,32.32
D6*  (via drill 0.3)
  Top 0.406: v38.42,18.67 46.99,18.67 51.44,23.11 51.44,29.78 U$4.27 | v35.56,21.21 26.99,29.78 v24.45,29.78
  Bottom 0.406: Q1.1 12.06,54.15 12.06,48.2 8.26,48.2 8.26,37.72 9.53,36.45 11.75,36.45 17.78,30.42 23.81,30.42 v24.45,29.78 | v38.42,18.67 37.15,18.67 36.83,18.99 36.83,21.21 v35.56,21.21
D7*  (via drill 0.3)
  Top 0.406: v82.55,21.21 81.28,22.48 81.28,32.96 83.5,35.18 v83.5,37.72 | v60.01,40.26 59.05,40.26 57.78,41.53 56.2,41.53 U$4.1
  Bottom 0.406: v82.55,21.21 R2.2 | v83.5,37.72 83.5,39.31 60.96,39.31 v60.01,40.26
D8*  (via drill 0.3)
  Top 0.406: v52.07,21.21 U$4.28
  Bottom 0.406: R35.1 89.53,48.51 89.22,48.51 89.22,41.21 89.85,40.58 91.44,40.58 91.44,23.11 90.49,22.16 55.24,22.16 54.29,21.21 v52.07,21.21
D9*  (via drill 0.3)
  Top 0.406: v31.75,20.26 36.51,20.26 36.51,28.19 36.2,28.51 36.2,28.83 v36.83,29.46 | v53.66,26.92 52.7,27.88 52.7,29.78 U$4.29
  Bottom 0.406: v31.75,20.26 30.48,20.26 Q8.1 | v36.83,29.46 43.5,29.46 44.13,28.83 53.66,28.83 54.61,27.88 54.61,26.92 v53.66,26.92
D10*  (via drill 0.3)
  Top 0.406: v53.66,27.88 53.66,29.78 U$4.30 | v46.35,27.56 42.86,24.07 40.96,24.07 v40.96,31.37
  Bottom 0.406: Q2.1 28.57,54.15 28.57,48.51 26.67,46.61 8.89,46.61 8.89,38.04 9.84,37.08 12.06,37.08 13.97,35.18 37.15,35.18 v40.96,31.37 | v53.66,27.88 53.34,27.56 v46.35,27.56
D11*  (via drill 0.3)
  Top 0.406: v18.41,11.37 17.78,12 v17.78,29.46 | v13.02,34.23 13.02,36.77 14.29,38.04 16.51,38.04 16.51,43.75 20.32,47.56 37.78,47.56 38.1,47.88 39.05,47.88 v39.05,45.97 | v44.13,39.94 46.04,39.94 U$4.12
  Bottom 0.406: v18.41,11.37 19.37,10.41 Q9.1 | v13.02,34.23 v17.78,29.46 | v39.05,45.97 40.32,44.7 47.94,44.7 53.34,39.31 53.34,38.35 46.99,38.35 45.4,39.94 v44.13,39.94
D12*  (via drill 0.3)
  Top 0.406: v48.58,39.31 49.21,38.67 49.21,37.72 50.48,36.45 50.48,30.1 U$4.26 | v38.42,44.7 40.96,44.7 v40.96,49.47
  Bottom 0.406: Q4.1 45.09,54.15 45.09,49.47 | 45.09,49.47 45.09,48.51 | v48.58,39.31 46.67,41.21 39.69,41.21 37.15,43.75 37.15,44.7 v38.42,44.7 | 45.09,49.47 v40.96,49.47
D13*  (via drill 0.3)
  Top 0.406: v53.02,22.16 53.02,22.8 55.24,25.02 55.24,29.78 U$4.32 | v49.53,22.16 48.58,22.16 47.31,20.89 38.1,20.89 38.1,30.1 36.2,32 36.2,35.5 32.7,38.99 R4.2
  Bottom 0.406: v49.53,22.16 v53.02,22.16
D18*  (via drill 0.3)
  Top 0.406: v39.05,30.42 v39.05,21.84 | v54.61,32.32 55.56,33.27 57.78,33.27 U$4.36
  Bottom 0.406: v39.05,21.84 38.1,21.84 38.1,20.26 Q11.1 | v39.05,30.42 43.18,30.42 44.13,31.37 53.66,31.37 v54.61,32.32
D+USB
  Top 0.406: X4.3 13.02,40.89 13.02,39.62 R24.2
D-USB
  Top 0.406: X4.2 13.02,41.69 13.02,42.8 R31.2
GND  (via drill 0.3)
  Top 0.406: C3.1 52.87,44.39 U$4.5 | C11.2 60.96,39.75 60.64,39.75 60.64,38.99 57.87,38.99 U$4.43
  Top 0.457: 7.92,25.2 U$6.GND2 7.94,25.34 10.16,27.56 10.16,38.04 | U$1.7 U$1.10 92.71,35.5 94.3,37.08 X1.1 93.98,37.08 93.03,38.04 93.03,41.85 91.12,43.75 73.34,43.75 | v35.56,41.21 36.2,40.58 v36.2,38.67 | v53.34,37.4 53.34,39.62 53.02,39.94 53.02,41.53 U$4.5 | v58.74,23.11 59.05,23.43 59.05,32.64 58.1,32.64 U$4.35 | v63.18,23.11 67.63,27.56 R3.1 | CFG.1 67.63,31.05 67.63,29.78 | R3.1 67.63,29.78 | R3.1 | 25.72,37.08 25.72,34.54 | 25.72,37.08 25.72,39.62 LED1.C | 25.72,37.08 LED4.C | 25.72,30.73 v27.94,30.73 | 25.72,30.73 RESET1.4 25.72,34.54 | 25.72,34.54 LED10.C | 14.29,35.81 14.29,33.27 LED18.C | 14.29,35.81 v14.29,37.08 | 14.29,35.81 LED19.C | 7.3,1.52 v7.3,4.7 | 47.94,36.13 47.94,34.86 48.26,34.54 48.26,31.05 47.94,30.73 47.94,30.1 U$4.23 47.94,29.78 v47.94,23.43 | 47.94,36.13 47.94,37.4 46.35,37.4 U$4.15 | 10.16,38.04 10.16,39.31 8.26,39.31 X4.5 | 60.96,39.75 60.96,45.97 60.48,46.45 | 60.48,46.45 58.74,48.2 58.74,48.83 59.37,49.47 73.34,49.47 | v60.64,46.61 60.48,46.45 | 10.16,38.04 v9.84,38.04 | 25.72,30.73 23.5,30.73 23.5,26.29 22.86,25.65 22.86,19.94 25.08,17.72 25.08,11.68 | 73.34,29.78 67.63,29.78 | 47.94,36.13 v48.58,36.13
  Top 1.676: I2C-J1.GND1 57.78,11.68 | I2C-J1.GND2 60.33,11.68 73.34,11.68 | RGB-J2.GND1 41.27,11.68
  Top 1.778: 24.13,11.68 22.54,11.68 22.54,1.52 7.3,1.52 1.27,1.52 1.27,10.41 7.62,10.41 7.62,19.26 U$6.GND1 U$6.GND2 | 24.13,11.68 25.08,11.68 41.27,11.68 57.78,11.68 60.33,11.68 | 73.34,11.68 73.34,29.78 73.34,43.75 73.34,49.47 73.34,58.67 | 81.28,58.67 85.09,58.67 84.45,59.31 J5.GND1 | 81.28,58.67 73.34,58.67 | 73.34,58.67 68.58,58.67 | 68.58,58.67 64.77,58.67 | 64.77,58.67 50.8,58.67 | 50.8,58.67 48.26,58.67 | 48.26,58.67 35.56,58.67 | 35.56,58.67 31.75,58.67 | 31.75,58.67 17.78,58.67 | 17.78,58.67 15.88,58.67 J1.GND2 | J1.GND1 18.41,59.31 17.78,58.67 | J2.GND2 32.38,59.31 31.75,58.67 | J2.GND1 34.92,59.31 35.56,58.67 | J3.GND2 48.9,59.31 48.26,58.67 | J3.GND1 51.44,59.31 50.8,58.67 | J4.GND2 65.41,59.31 64.77,58.67 | J4.GND1 67.94,59.31 68.58,58.67 | J5.GND2 81.92,59.31 81.28,58.67 | RGB-J1.GND1 24.77,11.05 24.13,11.68
  Bottom 0.406: C2.1 44.58,37.4 44.58,35.81 C8.1
  Bottom 0.457: 17.37,23.32 17.78,23.11 | C10.2 30.48,43.75 33.02,43.75 C12.1 33.02,43.43 34.61,41.85 34.92,41.85 v35.56,41.21 | v36.2,38.67 36.2,35.81 44.58,35.81 | 44.58,37.4 48.58,37.4 | 48.58,37.4 v53.34,37.4 | v63.18,23.11 v58.74,23.11 | v27.94,30.73 31.75,30.73 C9.2 | v14.29,37.08 14.45,37.24 | 14.45,37.24 16.51,39.31 C7.1 | 60.96,46.61 U$3.SND | 60.96,46.61 65.09,46.61 66.04,45.66 U$3.GND | CON1.GND 8.57,4.7 v7.3,4.7 | v47.94,23.43 47.94,23.11 | v60.64,46.61 60.96,46.61 | 14.45,37.24 13.65,38.04 v9.84,38.04 | v48.58,36.13 48.58,37.4
  Bottom 1.27: Q2.3 34.29,54.15 34.29,58.67 34.92,58.67 J2.GND1 | Q4.3 50.8,54.15 50.8,58.67 51.44,58.67 J3.GND1 | Q5.3 67.31,54.15 67.31,58.67 67.94,58.67 J4.GND1 | Q6.3 83.82,54.15 83.82,58.67 84.45,58.67 J5.GND1 | Q1.3 17.78,54.15 17.78,58.67 18.41,58.67 J1.GND1 | 25.63,23.11 17.78,23.11 17.78,20.02 Q10.3 17.62,19.62 17.14,19.62 17.14,12.95 | 25.63,23.11 Q8.3 | Q9.3 17.23,5.56 17.14,5.65 17.14,12.95 | RGB-J1.GND1 24.77,12.64 17.46,12.64 17.14,12.95 | Q7.3 48.26,20.02 48.26,23.11 47.94,23.11 40.96,23.11 | 40.96,23.11 40.87,23.11 | 40.87,23.11 Q12.3 40.96,20.02 40.96,23.11 | Q11.3 33.02,20.02 33.02,23.11 | 33.02,23.11 25.63,23.11 | 40.87,23.11 33.02,23.11 | RGB-J2.GND1 41.27,11.68 42.23,11.68 42.23,18.03 40.96,18.03 40.96,19.94
GND1  (via drill 0.3)
  Top 0.457: v85.41,38.35 85.41,42.8 82.87,42.8 82.23,42.16 81.28,42.16 LED9.C | v67.63,36.77 64.77,33.91 v64.77,30.1
  Bottom 0.457: v85.41,38.35 83.82,36.77 v67.63,36.77 | U$3.RUN v64.77,30.1
GND2  (via drill 0.3)
  Top 0.457: v77.47,35.81 77.47,40.58 78.74,41.85 LED11.C
  Bottom 0.457: v77.47,35.81 79.38,33.91 84.14,33.91 84.77,33.27 84.77,26.61 73.03,26.61 72.71,26.29 64.45,26.29 63.5,27.24 U$3.NET
GND3  (via drill 0.3)
  Top 0.457: v74.93,41.85 76.2,41.85 LED12.C | v69.85,41.53 68.58,40.26 v68.58,31.05
  Bottom 0.457: v74.93,41.85 74.61,41.53 v69.85,41.53 | v68.58,31.05 64.14,31.05 62.23,29.15 U$3.ALM
HWB  (via drill 0.3)
  Top 0.406: v54.93,20.89 54.93,23.75 55.88,24.7 55.88,29.78 U$4.33 | v69.53,21.21 R3.2
  Bottom 0.406: v54.93,20.89 55.24,21.21 v69.53,21.21
ISP+5V  (via drill 0.3)
  Top 0.406: v13.34,12 14.61,13.27 14.61,31.05 11.75,33.91 v11.75,38.99
  Bottom 0.406: CON1.5V 8.26,8.19 8.26,9.14 11.11,12 v13.34,12 | v11.75,38.99 10.79,38.99 9.84,39.94 9.84,44.7 D2.A
MISO  (via drill 0.3)
  Top 0.406: v12.06,9.46 15.24,12.64 v15.24,36.77 | v40.32,40.26 41.59,41.53 45.72,41.53 45.72,43.75 46.67,44.7 47.62,44.7 47.62,42.16 47.94,41.85 U$4.11 | v38.1,46.93 36.51,45.34 v36.51,45.02
  Bottom 0.406: Q5.1 61.59,54.15 61.59,48.51 60.64,47.56 51.12,47.56 49.53,45.97 40.01,45.97 39.05,46.93 v38.1,46.93 | v12.06,9.46 CON1.MISO | v15.24,36.77 16.51,38.04 23.18,38.04 23.81,37.4 33.97,37.4 36.83,40.26 39.05,40.26 | v40.32,40.26 39.05,40.26 | v36.51,45.02 36.51,42.48 36.83,42.48 39.05,40.26
MOSI  (via drill 0.3)
  Top 0.406: v7.3,6.29 10.79,6.29 10.79,14.86 13.34,17.4 v13.34,25.02 13.34,26.29 10.79,28.83 v10.79,39.94 | v41.91,46.93 43.5,45.34 v43.5,43.75 | v46.67,43.75 46.99,43.43 46.99,40.89 47.62,40.26 48.9,40.26 48.9,41.53 U$4.10 | v52.07,18.99 53.02,18.03 v53.02,13.59 | v49.21,10.1 46.99,7.87 34.29,7.87 v34.29,10.1 | v31.11,13.27 25.08,19.3 24.45,19.3 23.5,20.26 23.5,25.02 v23.81,25.34
  Bottom 0.406: v7.3,6.29 CON1.MOSI | v10.79,39.94 10.79,43.75 22.86,43.75 23.18,43.43 24.45,43.43 25.72,44.7 25.72,45.97 34.61,45.97 36.51,47.88 40.96,47.88 v41.91,46.93 | v46.67,43.75 v43.5,43.75 | v52.07,18.99 53.02,19.94 Q7.1 | v53.02,13.59 49.53,10.1 v49.21,10.1 | v31.11,13.27 v34.29,10.1 | v23.81,25.34 23.5,25.02 v13.34,25.02
N$1
  Bottom 1.27: Q4.2 48.26,58.67 46.35,58.67 J3.PWM
N$2
  Bottom 0.406: J2.I/O 31.11,65.66 40.01,65.66 R32.2
N$3
  Bottom 0.406: U$1.2 R1.1
N$4
  Top 0.406: R4.1 LED1.A
N$5
  Bottom 1.27: Q5.2 64.77,58.67 62.87,58.67 J4.PWM
N$6
  Bottom 1.27: Q10.2 20.32,18.03 25.4,18.03 25.4,15.49 27.3,15.49 RGB-J1.G
N$7
  Bottom 0.406: J3.I/O 47.62,65.66 56.52,65.66 R33.2
N$8
  Top 0.406: RL1.2 LED18.A
N$9
  Top 0.406: U$1.5 88.9,7.87 88.9,25.65 89.85,26.61 89.85,40.58 90.81,41.53 X1.2
N$10
  Bottom 1.27: RGB-J2.B 45.09,4.06 35.56,4.06 Q11.2
N$11  (via drill 0.3)
  Top 0.406: v62.87,26.29 63.18,26.61 v63.18,33.91 | v74.93,37.72 v74.93,34.86 | v63.18,38.35 63.5,38.67 v63.5,42.8
  Bottom 0.406: v62.87,26.29 61.28,24.7 60.96,24.7 R11.2 | v63.18,33.91 64.14,34.86 v74.93,34.86 | v74.93,37.72 74.3,38.35 v63.18,38.35 | U$3.RX1 v63.5,42.8
N$12
  Top 0.406: RL4.2 LED4.A
N$13
  Bottom 0.406: U$1.3 R2.1
N$14
  Top 0.406: RL7.2 LED19.A
N$15
  Top 0.406: U$1.4 86.36,7.87 86.36,32 X1.3
N$16
  Top 0.406: C3.2 49.53,44.39 | 49.53,44.39 49.53,44.7 | 49.53,44.39 49.53,42.8 52.07,42.8 U$4.6
N$18
  Bottom 0.406: J1.I/O 14.61,65.66 23.5,65.66 R.2
N$19
  Bottom 1.27: Q6.2 81.28,58.67 79.38,58.67 J5.PWM
N$20
  Bottom 1.27: RGB-J2.R 46.35,18.03 50.8,18.03 Q7.2
N$23
  Bottom 1.27: Q12.2 43.81,20.02 RGB-J2.G
N$24  (via drill 0.3)
  Top 0.406: v63.82,25.65 63.82,33.59 64.14,33.91 64.14,36.77 63.5,37.4 63.5,37.72 64.14,38.35 64.14,42.48 64.45,42.8 63.5,43.75 62.55,43.75 v62.55,42.8
  Bottom 0.406: v63.82,25.65 R8.2 | v62.55,42.8 62.55,44.7 U$3.TX1
N$25
  Top 0.406: R12.1 LED9.A
N$26
  Top 0.406: R14.1 LED11.A
N$27
  Top 0.406: R39.1 LED12.A
N$28
  Bottom 1.27: Q2.2 31.75,58.67 29.84,58.67 J2.PWM
N$29
  Bottom 0.406: J4.I/O 64.14,65.66 73.03,65.66 R34.2
N$32
  Bottom 0.406: J5.I/O 80.64,65.66 89.53,65.66 R35.2
N$34
  Bottom 1.27: Q1.2 15.24,58.67 13.34,58.67 J1.PWM
N$35  (via drill 0.3)
  Top 0.406: v60.64,34.86 v60.64,30.73 | v69.53,35.81 70.8,37.08 CFG.4
  Bottom 0.406: U$3.CFG 55.88,30.73 v60.64,30.73 | v60.64,34.86 61.59,35.81 v69.53,35.81
N$38  (via drill 1.1)
  Top 1.778: v1.27,57.4 1.27,59.26 F2.1
  Bottom 1.778: U$6.+5V 11.35,25.73 7.62,29.46 7.62,33.27 1.27,33.27 v1.27,57.4
N$39
  Bottom 1.778: U$6.+12V 11.35,17.95 7.62,14.22 7.62,10.41 1.27,10.41 F1.1
N$42  (via drill 0.6)
  Top 0.406: U$4.17 43.5,35.81 43.5,34.23 41.91,34.23 R13.2 41.91,33.25 | X3.P$2 41.91,33.25 | 41.91,33.25 v41.91,31.37
  Bottom 0.406: v41.91,31.37 41.91,33.14 C8.2
N$50
  Bottom 1.27: Q9.2 22.86,7.87 22.86,4.06 28.57,4.06 RGB-J1.B
N$68
  Bottom 1.27: RGB-J1.R 29.84,18.03 27.94,18.03 Q8.2
N$75
  Top 0.406: RL3.1 LED10.A
RD+
  Top 0.406: R24.1 20.32,39.62 20.32,42.16 45.09,42.16 45.09,45.97 53.67,45.97 U$4.4
RD-
  Top 0.406: R31.1 44.45,42.8 44.45,46.61 54.47,46.61 U$4.3
RESET  (via drill 0.3)
  Top 0.406: v11.75,4.38 16.83,9.46 v16.83,25.97 | v43.18,38.35 43.18,38.99 46.04,38.99 U$4.13 | v37.15,36.77 35.88,36.77 35.88,38.04 33.97,39.94 33.97,40.26 33.34,40.89 26.67,40.89 26.67,33.59 26.99,33.27 28.89,33.27 v28.89,29.78 | RESET1.2 25.4,27.56 v25.4,28.83
  Bottom 0.406: CON1.RESET 10.48,4.7 11.43,4.7 v11.75,4.38 | v16.83,25.97 19.37,28.51 25.4,28.51 | 25.4,28.51 R15.1 26.67,28.83 27.94,28.83 v28.89,29.78 30.16,29.78 31.75,28.19 C9.1 | v43.18,38.35 43.18,36.77 v37.15,36.77 | 25.4,28.51 v25.4,28.83
RX  (via drill 0.3)
  Top 0.406: v43.5,28.19 44.77,29.46 44.77,30.1 44.45,30.42 44.45,32.64 44.77,32.96 44.77,33.27 46.04,33.27 U$4.20 | v37.15,28.51 37.47,28.19 37.47,18.35 37.78,18.03 37.15,17.4 v37.15,13.27 | v69.22,13.91 68.9,14.22 68.9,20.89 66.99,22.8 v66.99,23.11
  Bottom 0.406: v43.5,28.19 43.18,28.51 v37.15,28.51 | v37.15,13.27 37.15,7.87 51.75,7.87 55.56,4.06 61.91,4.06 62.87,5.02 62.87,7.87 63.18,7.87 v69.22,13.91 | v66.99,23.11 R8.1
RXLED  (via drill 0.3)
  Top 0.406: v34.61,40.89 34.61,41.53 25.72,41.53 22.54,38.35 22.54,34.54 RL1.1 | v52.39,39.31 51.44,38.35 50.48,38.35 50.48,41.53 U$4.8
  Bottom 0.406: v34.61,40.89 35.24,40.26 35.56,40.26 36.51,41.21 36.51,41.85 36.2,41.85 35.56,42.48 35.56,45.97 38.1,45.97 41.59,42.48 49.21,42.48 v52.39,39.31
SCK  (via drill 0.3)
  Top 0.406: v46.04,3.11 57.78,3.11 57.78,7.24 58.42,7.87 v70.17,7.87 | v78.74,16.45 83.82,21.53 v83.82,32.96 83.82,34.54 84.45,35.18 v84.45,38.67 | v52.7,35.18 49.85,38.04 49.85,41.53 U$4.9
  Bottom 0.406: 79.06,54.15 Q6.1 78.11,54.15 78.11,49.15 | 78.11,49.15 78.11,48.51 | CON1.SCK 11.11,5.33 15.88,5.33 16.83,4.38 20.32,4.38 20.95,5.02 20.95,6.6 19.05,6.6 18.41,7.24 18.41,9.14 23.18,9.14 24.45,7.87 31.75,7.87 34.29,5.33 34.29,2.79 45.72,2.79 v46.04,3.11 | v78.74,16.45 v70.17,7.87 | v84.45,38.67 84.45,49.15 78.11,49.15 | v52.7,35.18 53.98,33.91 62.23,33.91 63.18,32.96 v83.82,32.96
SCL  (via drill 0.3)
  Top 0.406: v43.81,30.1 43.81,32.96 44.13,33.27 44.13,34.86 46.04,34.86 U$4.18 | v74.93,32 74.61,31.69 74.61,11.05 72.71,9.14 I2C-J1.SCL
  Bottom 0.406: I2C-J1.SCL 62.23,9.14 62.23,19.3 R30.2 | v43.81,30.1 44.45,30.73 54.93,30.73 56.2,32 v74.93,32
SDA  (via drill 0.3)
  Top 0.406: v46.99,24.7 47.31,25.02 47.31,31.05 47.62,31.37 47.62,34.23 46.35,34.23 U$4.19 | v55.88,19.94 v55.88,23.11
  Bottom 0.406: I2C-J1.SDA 61.59,4.7 55.88,4.7 55.88,12.32 59.69,12.32 59.69,18.03 | R29.2 59.69,19.3 59.69,18.03 | v46.99,24.7 47.31,24.38 49.21,24.38 50.48,23.11 v55.88,23.11 | v55.88,19.94 55.88,18.35 56.2,18.35 56.52,18.03 59.69,18.03
TX  (via drill 0.3)
  Top 0.406: v44.77,27.88 45.4,28.51 45.4,31.05 45.09,31.37 45.09,32.32 45.4,32.64 46.04,32.64 U$4.21
  Bottom 0.406: v44.77,27.88 47.62,25.02 58.1,25.02 R11.1
TXLED  (via drill 0.3)
  Top 0.406: v21.59,37.08 21.59,36.13 RL7.1 | v34.29,36.13 35.56,34.86 v35.56,25.02 | v42.86,25.02 46.04,28.19 46.04,31.69 U$4.22
  Bottom 0.406: v21.59,37.08 22.54,36.13 v34.29,36.13 | v42.86,25.02 v35.56,25.02
VUSB  (via drill 0.3)
  Top 0.406: v51.44,39.31 51.44,41.53 U$4.7 | v25.72,43.75 v38.1,43.75 | v12.06,42.48 8.26,42.48 X4.1
  Bottom 0.406: v51.44,39.31 48.9,41.85 40.01,41.85 v38.1,43.75 | v25.72,43.75 24.13,42.16 D4.A 16.51,42.16 C7.2 16.51,42.48 v12.06,42.48
XTAL1  (via drill 0.6)
  Top 0.406: U$4.16 46.27,36.45 43.5,36.45 43.5,37.24 R13.1 41.91,38.48 | X3.P$1 41.91,38.48 | 41.91,38.48 v41.91,40.26
  Bottom 0.406: v41.91,40.26 41.91,38.48 C2.2

### Text on the board
tNames: Halloween 2014 V1.0 | Halloween 2014 V1.0 | 1 | 1 | w5100 | Halloween 2014 V1.0
bNames: USB | TX/RX | LINKLED
tValues: HALLOWEEN 2014 - V1.2
203bmp: C:/Users/G/Pictures/logo_epfl.bmp